# EAGLE design captouch_reva (EAGLE 7.7.0)
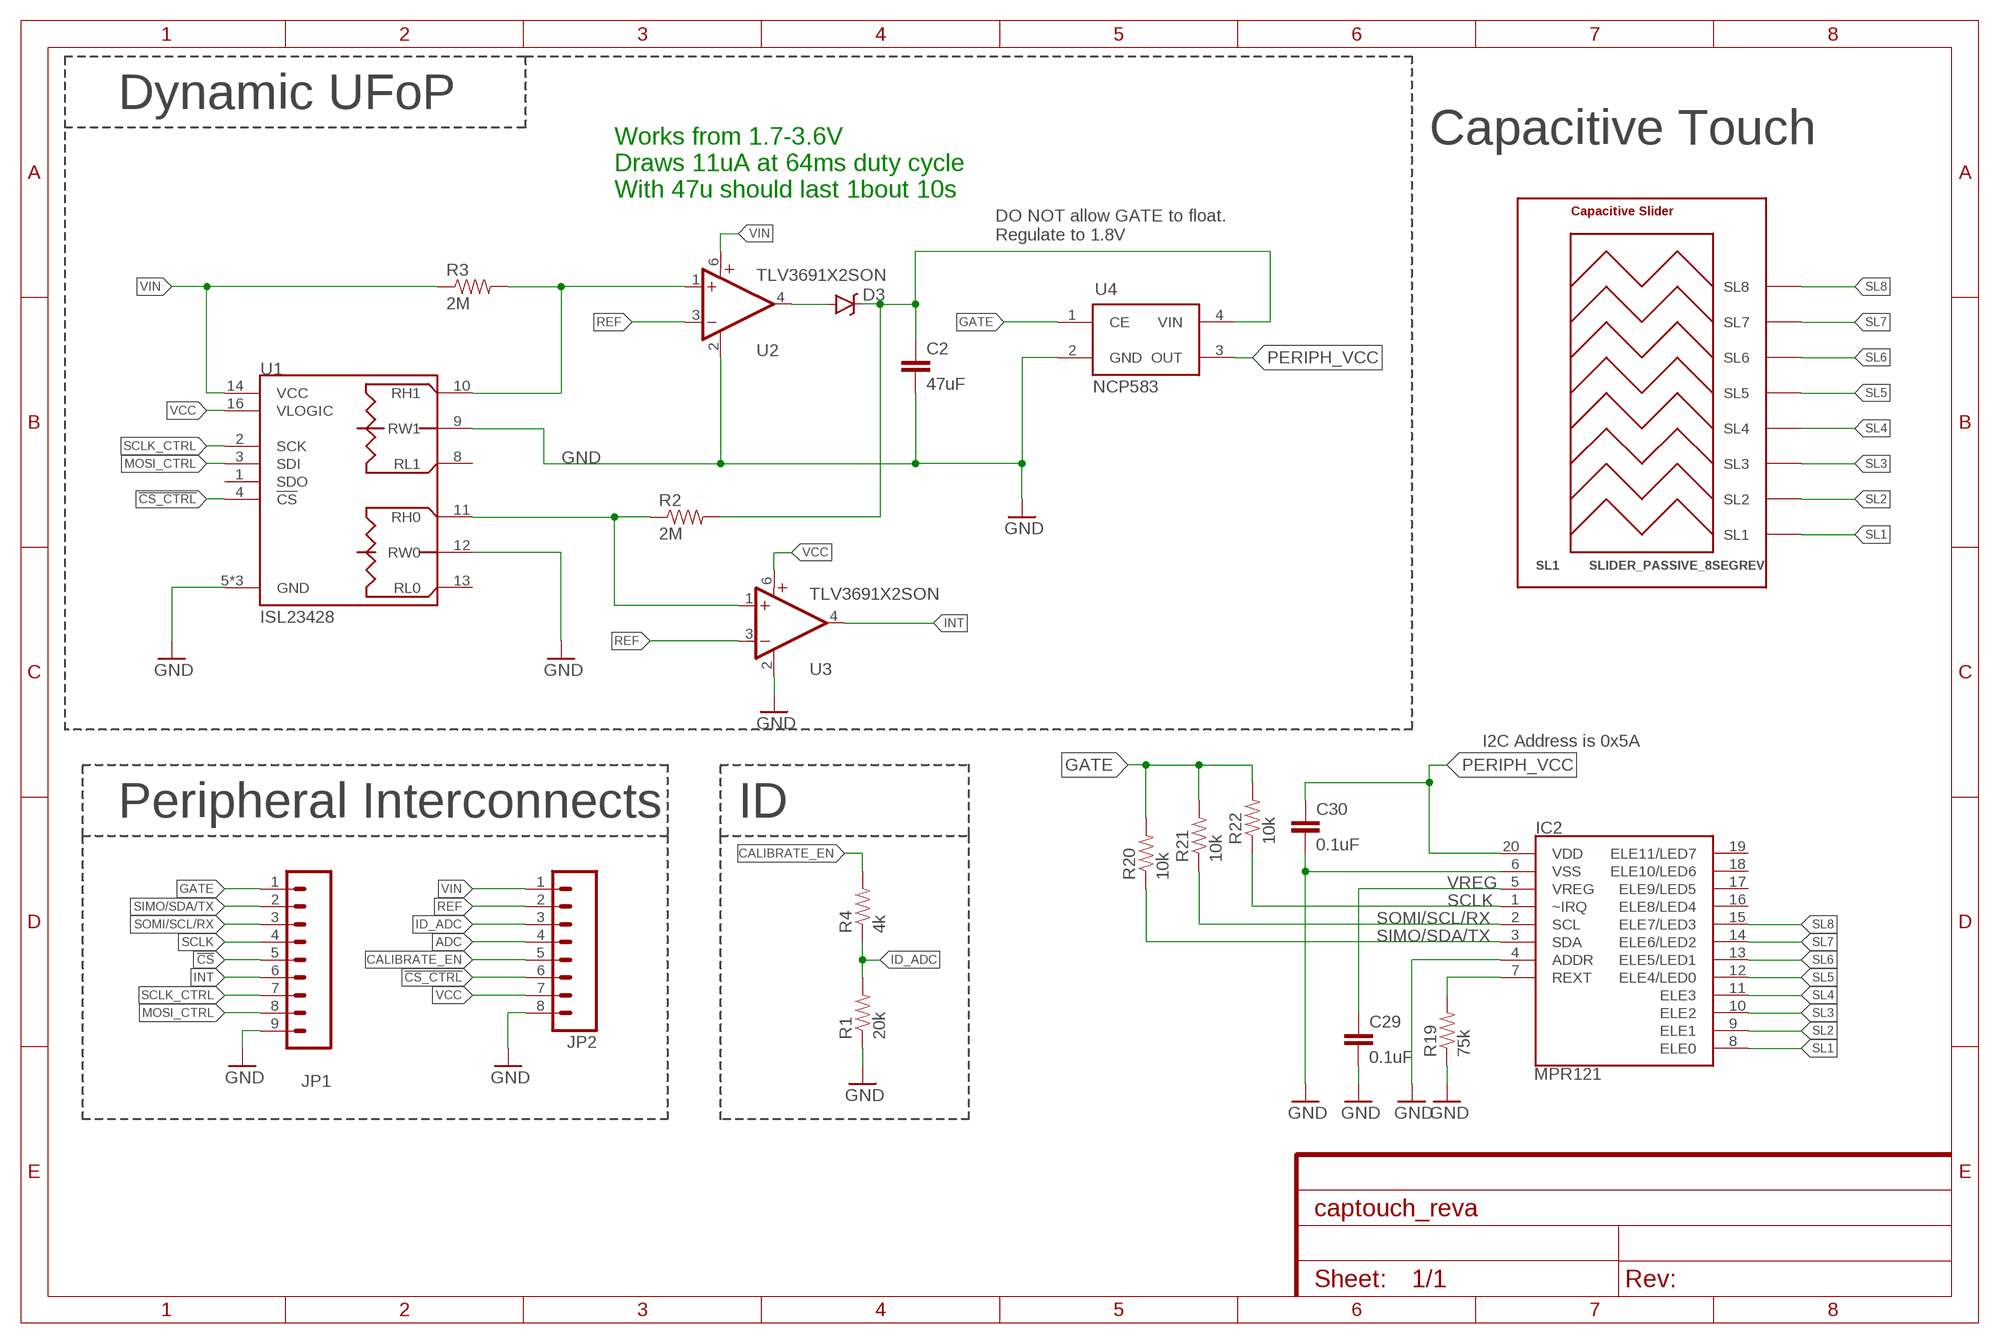
[diagram p0: schematic, sheet 1]
FRAME2 (FRAME-A4L): CNAME: CapTouch Peripheral; CREVISION: A; DESIGNER: Josiah Hester

## Parts
C2  47uF  CAP0805  [0805]
C29  0.1uF  C-EU  [0402]
C30  0.1uF  C-EU  [0402]
D3  RB751  DIODE-SCHOTTKY-RB751  [SOD-523]
IC2  MPR121  MPR121V2  [QFN-20-0.4MM-V2]
JP1  M091.27MM  [1X09-1.27MM]
JP2  M081.27MM  [1X08-1.27MM]
R1  20k  R-EU  [0402]
R2  2M  R-EU  [0402]
R3  2M  R-EU  [0402]
R4  4k  R-EU  [0402]
R19  75k  R-EU  [0402]
R20  10k  R-EU  [0402]
R21  10k  R-EU  [0402]
R22  10k  R-EU  [0402]
SL1  SLIDER_PASSIVE_8SEGREV  [SLIDER_PASSIVE_8SEG_12MM_REV]
U1  ISL23428  [UTQFN-16]
U2  TLV3691X2SON  [X2SON]
U3  TLV3691X2SON  [X2SON]
U4  NCP583  [SC82-AB_1PRIMARY]

## Nets
!CS: JP1.5
!CS_CTRL: JP2.6 U1.4(!CS)
ADC: JP2.4
CALIBRATE_EN: JP2.5 R4.2
GATE: JP1.1 R20.2 R21.2 R22.2 U4.1(CE)
GND: C2.2 C29.2 C30.2 IC2.4(ADDR) IC2.6(VSS) JP1.9 JP2.8 R1.1 R19.1 U1.5(GND) U1.6(GND) U1.9(RW1) U1.12(RW0) U1.15(GND) U2.2(GND) U3.2(GND) U4.2(GND)
ID_ADC: JP2.3 R1.2 R4.1
INT: JP1.6 U3.4(OUT)
MOSI_CTRL: JP1.8 U1.3(SDI)
N$1: D3.A U2.4(OUT)
N$2: C2.1 D3.C R2.2 U4.4(VIN)
N$4: R3.2 U1.10(RH1) U2.1(+IN)
N$5: R2.1 U1.11(RH0) U3.1(+IN)
PERIPH_VCC: C30.1 IC2.20(VDD) U4.3(OUT)
REF: JP2.2 U2.3(-IN) U3.3(-IN)
REXT: IC2.7(REXT) R19.2
SCLK: IC2.1(~IRQ) JP1.4 R22.1
SCLK_CTRL: JP1.7 U1.2(SCK)
SIMO/SDA/TX: IC2.3(SDA) JP1.2 R20.1
SL1: IC2.8(ELE0) SL1.SL1
SL2: IC2.9(ELE1) SL1.SL2
SL3: IC2.10(ELE2) SL1.SL3
SL4: IC2.11(ELE3) SL1.SL4
SL5: IC2.12(ELE4/LED0) SL1.SL5
SL6: IC2.13(ELE5/LED1) SL1.SL6
SL7: IC2.14(ELE6/LED2) SL1.SL7
SL8: IC2.15(ELE7/LED3) SL1.SL8
SOMI/SCL/RX: IC2.2(SCL) JP1.3 R21.1
VCC: JP2.7 U1.16(VLOGIC) U3.6(V+)
VIN: JP2.1 R3.1 U1.14(VCC) U2.6(V+)
VREG: C29.1 IC2.5(VREG)
Unconnected: IC2.16(ELE8/LED4) IC2.17(ELE9/LED5) IC2.18(ELE10/LED6) IC2.19(ELE11/LED7) U1.1(SDO) U1.8(RL1) U1.13(RL0)

## Notes on the sheet
- Dynamic UFoP
- Capacitive Touch
- Works from 1.7-3.6V
  Draws 11uA at 64ms duty cycle
  With 47u should last 1bout 10s
- DO NOT allow GATE to float.
  Regulate to 1.8V
- I2C Address is 0x5A
- Peripheral Interconnects | ID

## Library data of the parts
C2 = SparkFun-Capacitors:CAP: Capacitor Standard 0603 ceramic capacitor, and 0.1" leaded capacitor.; DIGIKEY: 490-9960-1-ND; MPN: GRM21BR60J476ME15L
C29 C30 = tiny_passives:C-EU; MPN: 0402YD104KAT2A
D3 = SparkFun-DiscreteSemi:DIODE-SCHOTTKY: Schottky diodes in SFE's production catalog BAT20J 1A 23V 0.62Vf RB751 120mA 40V 0.37Vf PMEG4005EJ 0.5A 40V 0.42Vf MBRA140 1A 40V 0.5Vf B340A 3A 40V SMA; DIGIKEY: BAS40-02V-V-G-08GICT-ND; MPN: BAS40-02V-V-G-08; PROD_ID: DIO-11018
IC2 = Testing:MPR121: MPR121 Capacitive Touch Sensor Controller. Variant "V2" was created using an image import of the bottom of the IC. It matches metal to metal.; ARROW: MPR121QR2; MPN: MPR121QR2
JP1 = SparkFun-Connectors:M09: Header 9 Standard 9-pin 0.1" header. Use with straight break away headers (SKU : PRT-00116), right angle break away headers (PRT-00553), swiss pins (PRT-00743), machine pins (PRT-00117), and female headers (PRT-00115).; DIGIKEY: S9014E-09-ND; MPN: GRPB091VWVN-RC
JP2 = SparkFun-Connectors:M08: Header 8 Standard 8-pin 0.1" header. Use with straight break away headers (SKU : PRT-00116), right angle break away headers (PRT-00553), swiss pins (PRT-00743), machine pins (PRT-00117), and female headers (PRT-00115).; DIGIKEY: S9014E-08-ND; MPN: GRPB081VWVN-RC
R1 = tiny_passives:R-EU; MPN: ERJ-2RKF2002X
R2 R3 = tiny_passives:R-EU; DIGIKEY: 1276-4293-1-ND; MPN: RC1005F205CS
R4 = tiny_passives:R-EU; MPN: RC0402FR-074K02L
R19 = tiny_passives:R-EU; DIGIKEY: 311-75KLRCT-ND; MPN: RC0402FR-0775KL
R20-R22 = tiny_passives:R-EU; MPN: ERJ-2RKF1002X
SL1 = TouchWidgets:SLIDER_PASSIVE_8SEG: Slider, Passive Type, Eight (8) Segments, 12mm wide Source : http://www.PatternAgents.com Github : https://github.com/PatternAgents License : http://creativecommons.org/licenses/by-sa/3.1/ (Creative Commons 3.1) THIS SOFTWARE IS PROVIDED BY THE CONTRIBUTORS "AS IS" AND WITHOUT ANY EXPRESS OR IMPLIED WARRANTIES, INCLUDING, BUT NOT LIMITED TO, THE IMPLIED WARRANTIES OF MERCHANTABILITY AND FITNESS FOR A PARTICULAR PURPOSE ARE DISCLAIMED. IN NO EVENT SHALL THE COPYRIGHT OWNER OR CONTRIBUTORS BE LIABLE FOR ANY DIRECT, INDIRECT, INCIDENTAL, SPECIAL, EXEMPLARY, OR CONSEQUENTIAL DAMAGES (INCLUDING, BUT NOT LIMITED TO, PROCUREMENT OF SUBSTITUTE GOODS OR SERVICES; LOSS OF USE, DATA, OR PROFITS; OR BUSINESS INTERRUPTION) HOWEVER CAUSED AND ON ANY THEORY OF LIABILITY, WHETHER IN CONTRACT, STRICT LIABILITY, OR TORT (INCLUDING NEGLIGENCE OR OTHERWISE) ARISING IN ANY WAY OUT OF THE USE OF THIS SOFTWARE, EVEN IF ADVISED OF THE POSSIBILITY OF SUCH DAMAGE.
U1 = isl23428:ISL23428: Intersil: Dual, 128-Tap, Low Voltage Digitally Controlled Potentiometer The ISL23428 is a volatile, low voltage, low noise, low power, 128-tap, dual digitally controlled potentiometer (DCP) with an SPI Bus™ interface. It integrates two DCP cores, wiper switches and control logic on a monolithic CMOS integrated circuit. Each digitally controlled potentiometer is implemented with a combination of resistor elements and CMOS switches. The position of the wipers are controlled by the user through the SPI bus interface. Each potentiometer has an associated volatile Wiper Register (WRi, i = 0, 1) that can be directly written to and read by the user. The contents of the WRi controls the position of the wiper. When powered on, the wiper of each DCP will always commence at mid-scale (64 tap position). The low voltage, low power consumption, and small package of the ISL23428 make it an ideal choice for use in battery operated equipment. In addition, the ISL23428 has a VLOGIC pin allowing down to 1.2V bus operation, independent from the VCC value. This allows for low logic levels to be connected directly to the ISL23428 without passing through a voltage level shifter. The DCP can be used as a three-terminal potentiometer or as a two-terminal variable resistor in a wide variety of applications including control, parameter adjustments, and signal processing; DIGIKEY: ISL23428TFRUZ-T7ACT-ND; MPN: ISL23428TFRUZ-T7A
U2 U3 = tlv3691:TLV3691: 0.9-V to 6.5-V, Nanopower Comparator Datasheets Analog Signal Chain Guide <http://www.ti.com/lit/pdf/slyb174> TLV3691 <http://www.ti.com/lit/ds/symlink/tlv3691.pdf> Manufacturer Product Page TLV3691IDPFR Specifications <http://www.ti.com/general/docs/suppproductinfo.tsp?distId=10&orderablePartNumber=TLV3691IDPFR> Standard Package <javascript:dlgHelp('Standard%20Packaging%20Help');> 1 Category Integrated Circuits (ICs) </product-search/en/integrated-circuits-ics> Family Linear - Comparators </product-search/en/integrated-circuits-ics/linear-comparators/2556221> Series - Packaging <javascript:dlgHelp('Standard%20Packaging%20Help');> Cut Tape (CT) <javascript:dlgHelp('Cut%20Tape%20Help');> Type General Purpose Number of Elements 1 Output Type Push-Pull Voltage - Supply, Single/Dual (±) 0.9 V ~ 6.5 V, ±0.45 V ~ 3.25 V Voltage - Input Offset (Max) 3mV Current - Input Bias (Max) 100pA Current - Output (Typ) 42mA Current - Quiescent (Max) 150nA CMRR, PSRR (Typ) - Propagation Delay (Max) 35µs Hysteresis - Operating Temperature -40°C ~ 125°C Package / Case 6-XFDFN Mounting Type Surface Mount Supplier Device Package 6-X2SON (1x1) Online Catalog Comparators - 1 element </catalog/en/partgroup/comparators-1-element/3112?mpart=TLV3691IDPFR&vendor=296&WT.z_ref_page_type=PS&WT.z_ref_page_sub_type=PD&WT.z_ref_page_id=PD&WT.z_ref_page_event=DC_Link_Table> Other Names 296-37242-1; DIGIKEY: 296-37242-1-ND; MPN: TLV3691IDPFR
U4 = ncp583:NCP583: NCP583 - Ultra-Low Iq 150 mA CMOS LDO Regulator with Enable The NCP583 series of low dropout regulators are designed for portable battery powered applications which require precise output voltage accuracy and low quiescent current. These devices feature an enable function which lowers current consumption significantly and are offered in two small packages; SC−82AB and the SOT−563. A 1.0 mF ceramic capacitor is the recommended value to be used with these devices on the output pin.; MPN: NCP583SQ18T1G

## Board
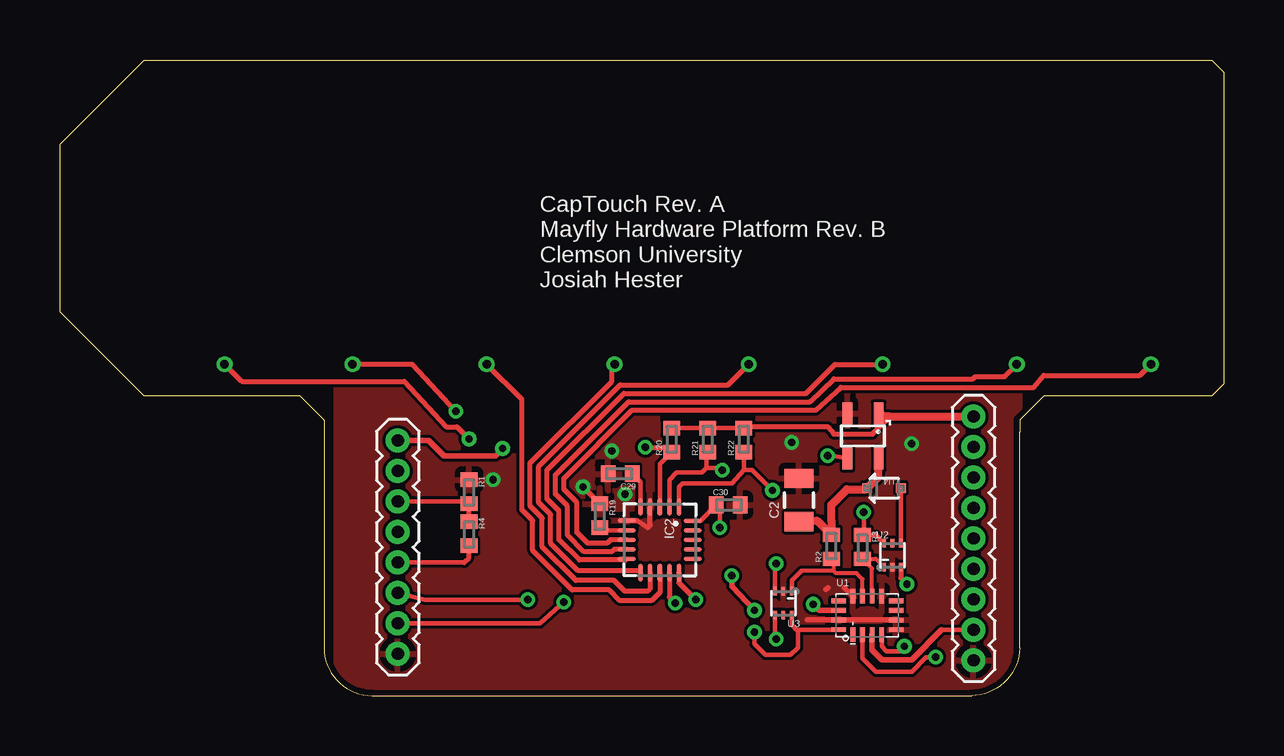
[diagram p1: board, top side]
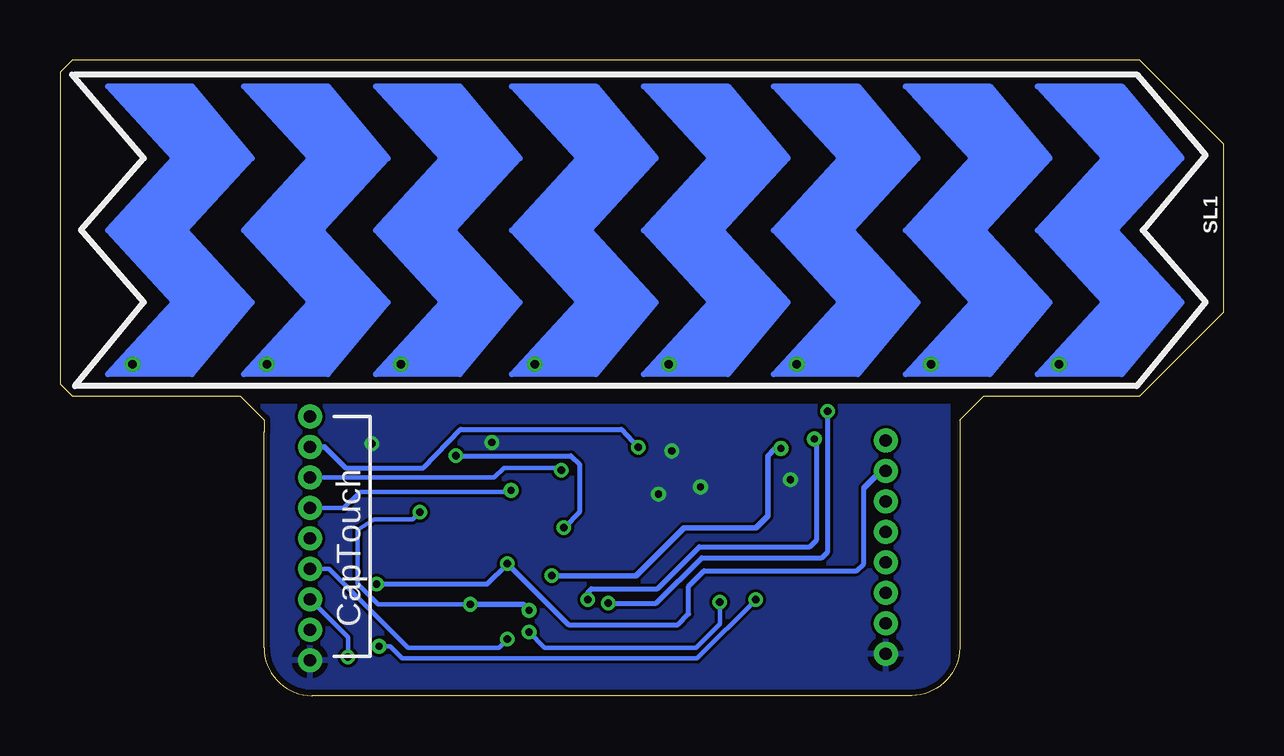
[diagram p2: board, bottom side, seen from below]

Size 48.5 x 26.5 mm. Coordinates in mm from the lower left corner, seen from the top.
Outline: 11,11 11,2 arc90 13,0 38,0 arc90 40,2 40,11 40,11.5 41,12.5 48,12.5 48.5,13 48.5,26 48,26.5 3.5,26.5 0,23 0,16 3.5,12.5 10,12.5 11,11.5 11,11
Copper layers (1*16): Top 0.035mm / dielectric 1.5mm / Bottom 0.035mm
Design rules "MF_Standard_2_Layer": minimum track width 5mil, minimum drill 12mil, track to track 5mil, track to pad 5mil, pad to pad 5mil, via to via 5mil, smd to smd 0mil, copper to edge 10mil, drill to drill 10mil, minimum pad ring 6mil, minimum via ring 6mil, stop-mask expansion 2mil, vias tented up to drill 25mil, thermal gap 10mil

### Footprints (pad centres in the part's own frame; a part is rotated, then mirrored left to right if it is on the bottom)
0805 = smd 0.8 x 1.2: 1 -0.9,0; 2 0.9,0
0402 = smd 0.6 x 0.7: 1 -0.5,0; 2 0.5,0
SOD-523 = smd 0.4 x 0.4: A -0.7,0; C 0.7,0
QFN-20-0.4MM-V2 = smd 0.75 x 0.195: 1 -1.367,0.8; 2 -1.367,0.4; 3 -1.367,0; 4 -1.367,-0.4; 5 -1.367,-0.8; 11 1.375,-0.8; 12 1.375,-0.4; 13 1.375,0; 14 1.375,0.4; 15 1.375,0.8 | smd 0.195 x 0.75: 6 -0.795,-1.372; 7 -0.395,-1.372; 8 0.005,-1.372; 9 0.405,-1.372; 10 0.805,-1.372; 16 0.81,1.372; 17 0.41,1.372; 18 0.01,1.372; 19 -0.39,1.372; 20 -0.79,1.372
1X09-1.27MM = drill 0.508 pad 1: 1 0,0; 2 1.27,0; 3 2.54,0; 4 3.81,0; 5 5.08,0; 6 6.35,0; 7 7.62,0; 8 8.89,0; 9 10.16,0
1X08-1.27MM = drill 0.508 pad 1: 1 0,0; 2 1.27,0; 3 2.54,0; 4 3.81,0; 5 5.08,0; 6 6.35,0; 7 7.62,0; 8 8.89,0
SLIDER_PASSIVE_8SEG_12MM_REV = drill 0.356: SL1 5.588,-20.32; SL2 5.588,-14.732; SL3 5.588,-9.144; SL4 5.588,-3.556; SL5 5.588,2.032; SL6 5.588,7.366; SL7 5.588,12.954; SL8 5.588,18.288
UTQFN-16 = smd 0.2 x 0.6: 1 -0.6,-0.8; 2 -0.2,-0.8; 3 0.2,-0.8; 4 0.6,-0.8; 9 0.6,0.8; 10 0.2,0.8; 11 -0.2,0.8; 12 -0.6,0.8 | smd 0.6 x 0.2: 5 1.2,-0.6; 6 1.2,-0.2; 7 1.2,0.2; 8 1.2,0.6; 13 -1.2,0.6; 14 -1.2,0.2; 15 -1.2,-0.2; 16 -1.2,-0.6
X2SON = smd 0.152 x 0.35: 1 -0.35,-0.5; 2 0,-0.5; 3 0.35,-0.5; 4 0.35,0.5; 5 0,0.5; 6 -0.35,0.5
SC82-AB_1PRIMARY = smd 0.406 x 0.914: 1 -0.621,-0.913; 2 0.675,-0.913; 3 0.675,0.967; 4 -0.621,0.967

### Placement (x,y rotation side)
C2  30.8,8.15 90 top
C29  23.35,9.25 180 top
C30  27.85,7.95 0 top
D3  34.35,8.65 180 top
IC2  25,6.5 270 top
JP1  38.08,11.63 270 top
JP2  14.08,10.63 270 top
R1  17.05,8.5 270 top
R2  32.15,6.2 90 top
R3  33.45,6.2 270 top
R4  17.05,6.75 270 top
R19  22.5,7.5 270 top
R20  25.5,10.65 90 top
R21  27,10.65 90 top
R22  28.5,10.65 90 top
SL1  25.15,19.4 270 bottom
U1  33.65,3.35 0 top
U2  34.7,5.85 0 top
U3  30.15,3.85 180 top
U4  33.5,10.85 180 top

### Tracks (layer width: path | path; a pad name or v marks a point on that pad's centre or on a via)
!CS_CTRL  (via drill 0.3)
  Top 0.18: U1.4 34.25,2.05 34.45,1.85 35,1.85 v35.2,2.05 | v19.5,4 15.21,4 JP2.6
  Bottom 0.18: v35.2,2.05 34.75,2.05 34.25,1.55 21.95,1.55 v19.5,4
CALIBRATE_EN
  Top 0.18: JP2.5 16.85,5.55
  Top 0.2: 16.85,5.55 17.05,5.75 R4.2
GATE
  Top 0.18: R22.2 R21.2 R20.2
  Top 0.2: 34.6,11.63 33.87,10.9 32.25,10.9 32,11.2 28.55,11.2 R22.2
  Top 0.33: U4.1 34.4,11.63 34.6,11.63 JP1.1
GND  (via drill 0.3)
  Top 0.2: R19.1 v21.8,8.7 | IC2.6 24.05,7.29 24.5,7 24.6,7.1 IC2.4
  Top 0.222: U1.6 U1.15 31.15,3.15 | U1.12 32.7,4.5 | 32,4.5 31.93,4.42
  other vias: 35.5,10.5 30.5,10.55 23,10.2 18.05,9 23.55,8.4
  pour Bottom (rank 2): 40.5,0 11.5,0 11.5,13.5 40.5,13.5
  pour Top: 40,0 11.5,0 11.5,13.5 40,13.5
ID_ADC
  Top 0.18: JP2.3 16.71,8.09
  Top 0.2: R4.1 R1.2 16.8,8 16.71,8.09
INT  (via drill 0.3)
  Top 0.18: v29.85,2.35 29.8,2.4 U3.4
  Bottom 0.18: 37.28,5.28 34,2 30.2,2 v29.85,2.35
  Bottom 0.19: 37.28,5.28 JP1.6
MOSI_CTRL
  Top 0.19: 36.74,2.74 JP1.8
  Top 0.222: 36.74,2.74 35.5,1.5 34.25,1.5 33.85,1.9 U1.3
N$1
  Top 0.19: U2.4 D3.A
N$2
  Top 0.222: 32.1,7.35 32.15,7.3
  Top 0.33: D3.C 33.65,8.7 | 34.1,10.01 U4.4
  Top 0.333: 34.1,10.01 34.1,9.1 D3.C 33.6,8.6 32.8,8.6 32.15,7.95 32.15,7.3 R2.2 31.55,7.3 C2.1
N$4
  Top 0.16: U2.1 34,5.7 R3.2 33.85,5.3 U1.10
N$5
  Top 0.16: U1.11 33.45,4.85 33.2,5.1 32.35,5.1 32.25,5.2 | 32.25,5.2 32.25,5.6 R2.1 | 32.25,5.2 30.9,5.2
  Top 0.18: 30.9,5.2 30.5,4.8 U3.1
PERIPH_VCC  (via drill 0.3)
  Top 0.18: IC2.20 26.69,7.29 C30.1 27.5,7.8 v27.5,7 | U4.3 32.03,10.03 v32,10
  Bottom 0.2: v32,10 27.2,10 26.85,9.65 26.85,7.65 v27.5,7
REF  (via drill 0.3)
  Top 0.18: v29.85,5.5 29.8,5.45 U3.3
  Top 0.2: U2.3 35.05,4.9 v35.3,4.65
  Bottom 0.2: v35.3,4.65 30.7,4.65 v29.85,5.5 27.3,2.95 22.75,2.95 22.3,3.4 22.3,4.55 21.65,5.2 15.3,5.2 15,5.5 15,8.65
  Bottom 0.22: 15,8.65 14.29,9.36 JP2.2
REXT
  Top 0.18: IC2.7 22.61,6.89 R19.2
SCLK  (via drill 0.3)
  Top 0.18: IC2.1 25.8,8.7 25.95,8.85 28,8.85 28.5,9.4 | 28.5,9.4 R22.1 | 28.5,9.4 28.85,9.4 v29.7,8.55
  Bottom 0.18: 36.68,7.82 36,8.5 29.75,8.5 v29.7,8.55
  Bottom 0.19: 36.68,7.82 JP1.4
SCLK_CTRL  (via drill 0.3)
  Top 0.18: U1.2 33.45,1.55 34,1 35.5,1 36.1,1.6 v36.5,1.6
  Bottom 0.18: 36.5,2.43 v36.5,1.6
  Bottom 0.19: 36.5,2.43 JP1.7
SIMO/SDA/TX  (via drill 0.3)
  Top 0.18: IC2.3 25,9.65 R20.1
  Top 0.2: v24.4,10.35 25.3,10.35 R20.1
  Bottom 0.2: 37.46,10.36 36.6,9.5 33.35,9.5 31.8,11.1 25.1,11.1 v24.4,10.35
  Bottom 0.222: 37.46,10.36 JP1.2
SL1
  Top 0.2: IC2.8 22.95,6.5 22.8,6.35 22,6.35 21.55,6.8 21.55,8.05 21,8.6 21,9.05 23.85,11.9 31.5,11.9 32.55,12.85 40.6,12.85 41,13.35 45.01,13.35 SL1.SL1
SL2
  Top 0.2: IC2.9 23.09,6.09 23,6 21.85,6 21.15,6.7 21.15,7.9 20.65,8.4 20.65,9.2 23.7,12.25 31.25,12.25 32.25,13.2 38.05,13.2 38.15,13.3 39.37,13.3 SL1.SL2
SL3
  Top 0.2: IC2.10 23.58,5.65 21.65,5.65 20.8,6.5 20.8,7.7 20.3,8.2 20.3,9.4 23.5,12.6 31.1,12.6 32.31,13.81 SL1.SL3
SL4
  Top 0.2: IC2.11 24.12,5.2 21.6,5.2 20.45,6.35 20.45,7.55 19.95,8.05 19.95,9.55 23.35,12.95 27.84,12.95 SL1.SL4
SL5
  Top 0.2: IC2.12 24.6,4.45 24.5,4.35 23.55,4.35 23.1,4.8 21.5,4.8 20.1,6.2 20.1,7.4 19.6,7.9 19.6,9.7 23,13.1 23,13.69 SL1.SL5
SL6
  Top 0.2: IC2.13 25,4.3 24.65,3.95 23.35,3.95 22.9,4.4 21.35,4.4 19.7,6.05 19.7,7.3 19.25,7.75 19.25,12.35 SL1.SL6
SL7  (via drill 0.3)
  Top 0.2: IC2.14 25.4,4.1 v25.65,3.85 | v16.5,11.85 14.69,13.81 SL1.SL7
  Bottom 0.2: v25.65,3.85 23.65,3.85 21.75,5.75 16.75,5.75 16.5,6 v16.5,11.85
SL8  (via drill 0.3)
  Top 0.2: IC2.15 25.8,4.7 v26.5,4 | SL1.SL8 7.57,13.1 14.35,13.1 16.1,11.2 16.55,11.2 v17.05,10.7
  Bottom 0.2: v26.5,4 26.5,4.3 26.35,4.45 23.6,4.45 21.85,6.2 17.25,6.2 16.95,6.5 16.95,10.65 v17.05,10.7
SOMI/SCL/RX  (via drill 0.3)
  Top 0.18: IC2.2 25.4,9 25.7,9.3 26.75,9.3 26.95,9.5 | 26.95,9.5 26.95,9.95 R21.1 | 26.95,9.5 27.5,9.5 v27.6,9.4
  Bottom 0.18: 30.41,9.09 30,9.5 27.7,9.5 v27.6,9.4
  Bottom 0.19: JP1.3 30.41,9.09
VCC  (via drill 0.3)
  Top 0.18: U3.6 30.5,2.95 30.7,2.75 | 30.7,2.75 U1.16 | JP2.7 20.01,3.01 v21,3.9 | v28.95,2.65 28.95,2.15 29.4,1.7 30.45,1.7 30.75,2 30.75,2.7 30.7,2.75
  Bottom 0.19: v21,3.9 21,3 22,2 28.3,2 v28.95,2.65
VIN  (via drill 0.3)
  Top 0.18: R3.1 34,6.7 U2.6
  Top 0.19: v33.5,7.65 33.5,6.75 R3.1
  Top 0.22: v28.95,3.55 28,4.55 v28,5 | v18.45,10.3 18.15,10 16,10 15.37,10.63 JP2.1
  Top 0.222: U1.14 31.65,3.55 v31.4,3.8
  Bottom 0.18: v31.4,3.8 35.25,3.8 36.1,4.65
  Bottom 0.19: 36.1,4.65 36.1,6.9 35.4,7.35 33.8,7.35 v33.5,7.65
  Bottom 0.22: v28,5 24.5,5 22.5,7 19.5,7 19,7.5 19,10 18.7,10.3 v18.45,10.3 | v31.4,3.8 29.2,3.8 v28.95,3.55
VREG
  Top 0.18: IC2.5 24.2,8.9 C29.1

### Text on the board
tPlace: CapTouch Rev. A / Mayfly Hardware Platform Rev. B / Clemson University / Josiah Hester
bPlace: CapTouch